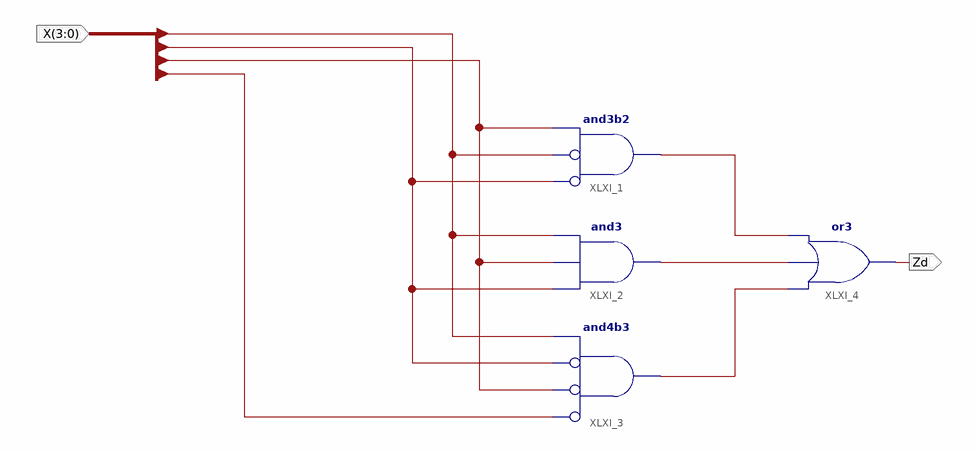
[diagram p0: schematic sheet 1]
// Xilinx ISE schematic d.sch (spartan3e) as structural Verilog: 4 symbols, 2 ports
module d (
  input  [3:0] X,
  output Zd
);

  wire XLXN_15, XLXN_16, XLXN_17;

  and XLXI_1 (XLXN_16, ~X[1], ~X[0], X[2]);  // and3b2
  and XLXI_2 (XLXN_15, X[1], X[2], X[0]);
  and XLXI_3 (XLXN_17, ~X[3], ~X[2], ~X[1], X[0]);  // and4b3
  or XLXI_4 (Zd, XLXN_17, XLXN_15, XLXN_16);
endmodule
